# Altium schematic sheet Alimentation.SchDoc
size Letter; Organization: Cegep Limoilou; Address1: 1300, 8e Avenue; Address2: Québec, QC; Address3: Canada; Address4: G1J 5L5; Revision: Enseignants; SheetNumber: 5; SheetTotal: 8; Conception: Ilyes Gharmoul; Titre: Alimentation; Modification: Ilyes G
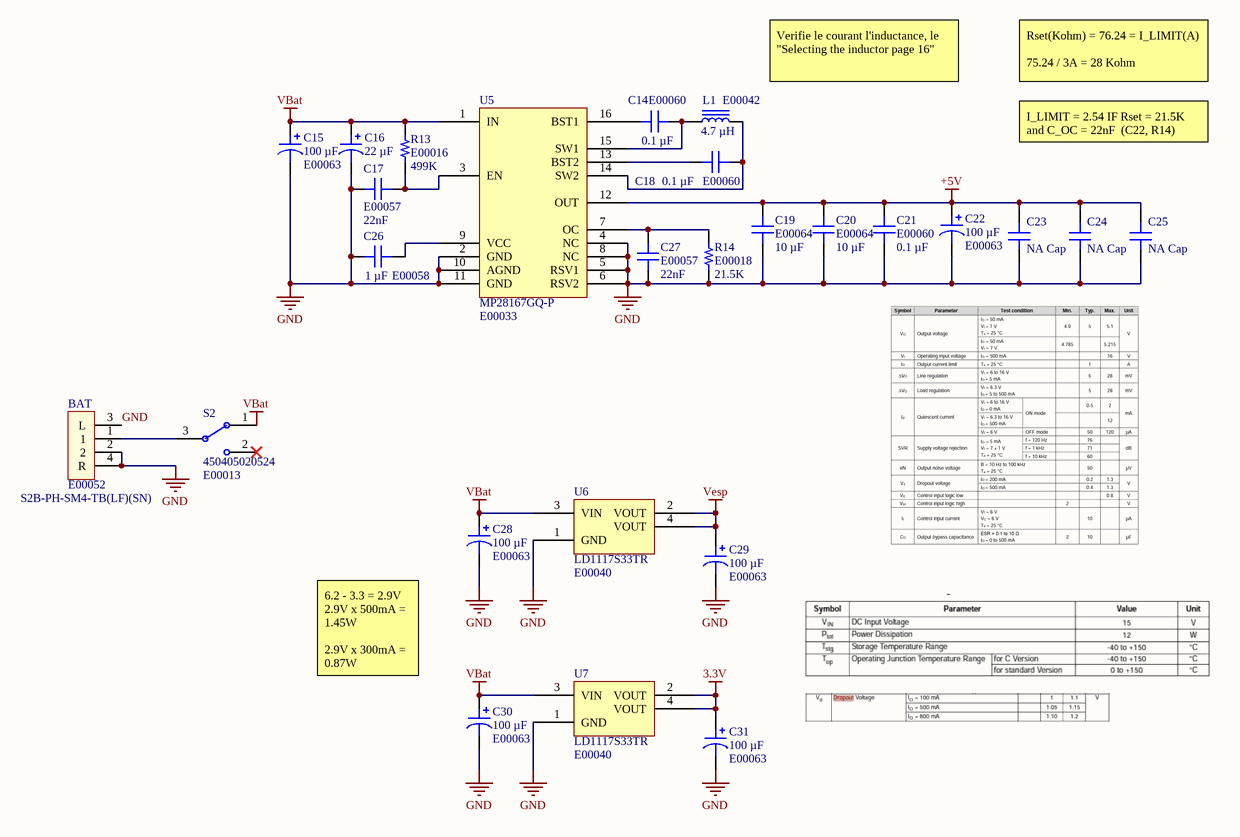
[diagram p0: Alimentation.SchDoc]

## Parts
BAT  ADAM Inventory Number 1: E00052  Supplier Part Number 1: S2B-PH-SM4-TB(LF)(SN)  [S2B-PH-SM4-TB_LF__SN]  (hidden comment: CONN JST 2P SM 90DEG)
C14  ADAM Inventory Number 1: E00060  [CAP 0603]  (hidden comment: 0.1 µF)
C15  100 µF  ADAM Inventory Number 1: E00063  [CAP ALSMD ELEC 8.3MM H10.5MM]
C16  22 µF  [CAP ALSMD 4.3MM H5.4MM]
C17  ADAM Inventory Number 1: E00057  [CAP 0603]  (hidden comment: 22nF)
C18  ADAM Inventory Number 1: E00060  [CAP 0603]  (hidden comment: 0.1 µF)
C19  ADAM Inventory Number 1: E00064  [CAP 0603]  (hidden comment: 10 µF)
C20  ADAM Inventory Number 1: E00064  [CAP 0603]  (hidden comment: 10 µF)
C21  ADAM Inventory Number 1: E00060  [CAP 0603]  (hidden comment: 0.1 µF)
C22  100 µF  ADAM Inventory Number 1: E00063  [CAP ALSMD ELEC 8.3MM H10.5MM]
C23  NA Cap  [CAP 0603]
C24  NA Cap  [CAP 0603]
C25  NA Cap  [CAP 0603]
C26  ADAM Inventory Number 1: E00058  [CAP 0603]  (hidden comment: 1 µF)
C27  ADAM Inventory Number 1: E00057  [CAP 0603]  (hidden comment: 22nF)
C28  100 µF  ADAM Inventory Number 1: E00063  [CAP ALSMD ELEC 8.3MM H10.5MM]
C29  100 µF  ADAM Inventory Number 1: E00063  [CAP ALSMD ELEC 8.3MM H10.5MM]
C30  100 µF  ADAM Inventory Number 1: E00063  [CAP ALSMD ELEC 8.3MM H10.5MM]
C31  100 µF  ADAM Inventory Number 1: E00063  [CAP ALSMD ELEC 8.3MM H10.5MM]
L1  4.7 µH  ADAM Inventory Number 1: E00042  [IND 4.7UH 4.6A]
R13  ADAM Inventory Number 1: E00016  [RES 0603]  (hidden comment: 499K)
R14  ADAM Inventory Number 1: E00018  [RES 0603]  (hidden comment: 21.5K)
S2  450405020524  ADAM Inventory Number 1: E00013  [SL 3Pos Switch]
U5  MP28167GQ-P  ADAM Inventory Number 1: E00033  [MP2816GQ-P]
U6  LD1117S33TR  ADAM Inventory Number 1: E00040  [SOT-223]
U7  LD1117S33TR  ADAM Inventory Number 1: E00040  [SOT-223]

## Nets
3.3V: C31.1 U7.2(VOUT) U7.4(VOUT)
+5V: C19.2 C20.2 C21.2 C22.1 C23.1 C24.1 C25.1 U5.12(OUT)
GND: BAT.2 BAT.3(L) BAT.4(R) C15.2 C16.2 C17.1 C19.1 C20.1 C21.1 C22.2 C23.2 C24.2 C25.2 C26.2 C27.1 C28.2 C29.2 C30.2 C31.2 R14.1 U5.2(GND) U5.4(NC) U5.5(RSV1) U5.6(RSV2) U5.8(NC) U5.10(AGND) U5.11(GND) U6.1(GND) U7.1(GND)
VBat: C15.1 C16.1 C28.1 C30.1 R13.2 S2.1 U5.1(IN) U6.3(VIN) U7.3(VIN)
Vesp: C29.1 U6.2(VOUT) U6.4(VOUT)
NetBAT_1: BAT.1 S2.3(COM)
NetC14_1: C14.1 L1.1 U5.15(SW1)
NetC14_2: C14.2 U5.16(BST1)
NetC17_2: C17.2 R13.1 U5.3(EN)
NetC18_1: C18.1 L1.2 U5.14(SW2)
NetC18_2: C18.2 U5.13(BST2)
NetC26_1: C26.1 U5.9(VCC)
NetC27_2: C27.2 R14.2 U5.7(OC)

Not connected (* = marked no-connect by the designer): S2 2*

## Notes on the sheet
- Verifie le courant l'inductance, le "Selecting the inductor page 16"
- Rset(Kohm) = 76.24 = I_LIMIT(A)
  75.24 / 3A = 28 Kohm
- I_LIMIT = 2.54 IF Rset = 21.5K and C_OC = 22nF  (C22, R14)
- 6.2 - 3.3 = 2.9V
  2.9V x 500mA =
  1.45W
  2.9V x 300mA =
  0.87W
- Titre :
- Conception :
- Date :
- Modification :
- Heure :
- Révision :
- Feuille
- de
- Fichier :

## Library data of the parts
BAT = CONN JST 2P SM 90DEG: CONN SM JST 2P; Copyright: Copyright (C) 2023 Ultra Librarian. All rights reserved.; Mfr_Name: JST; Manufacturer Part Number 1: S2B-PH-SM4-TB(LF)(SN); RefDes: RefDes; Type: DEV; Supplier 1: Arrow Electronics; Parameter 1: *
C14 C18 C21 = CAP CER 0.1UF 50V X7R 0603: Manufacturer Part Number 1: C0603C104K5RAC7411; manufacturer: KEMET; Tolerance: ±10%; Applications: Bypass, Decoupling; Capacitance: 0.1 µF; componentlink1description: Datasheet; componentlink1url: https://api.kemet.com/component-edge/download/datasheet/C0603C104K5RAC7411.pdf; componentlink2description: DigiKey Link; componentlink2url: https://www.digikey.com/en/products/detail/kemet/C0603C104K5RAC7411/3317013; Device Package: 0603 (1608 Metric); lastupdated: 2023-03-28 19:09:05; Lifecycle Status: Active; Minimum Order: 1; Mounting Type: Surface Mount, MLCC; Operating Temperature: -55°C ~ 125°C; Package / Case: 0603 (1608 Metric); packaging: TapeAndReel; partid: 2233; Part Status: Active; price: 0.01; series: SMD Comm X7R; Size / Dimension: 0.063" L x 0.031" W (1.60mm x 0.80mm); Supplier 1: DigiKey; Supplier Part Number 1: 399-C0603C104K5RAC7411CT-ND; Temperature Coefficient: X7R; Thickness (Max): 0.035" (0.90mm); Voltage - Rated: 50V; Value: 0.1 µF
C15 C22 C28-C31 = CAP ALUM 100UF 20% 50V SMD: Manufacturer Part Number 1: UWT1H101MNL1GS; manufacturer: Nichicon; Lifetime @ Temp.: 1000 Hrs @ 105°C; Polarization: Polar; Ripple Current @ High Frequency: 210 mA @ 10 kHz; Ripple Current @ Low Frequency: 140 mA @ 120 Hz; Surface Mount Land Size: 0.327" L x 0.327" W (8.30mm x 8.30mm); Applications: General Purpose; Capacitance: 100 µF; componentlink1description: Datasheet; componentlink1url: https://products.nichicon.co.jp/en/pdf/XJA043/e-uwt.pdf; componentlink2description: DigiKey Link; componentlink2url: https://www.digikey.com/en/products/detail/nichicon/UWT1H101MNL1GS/589967; Device Package: Radial, Can - SMD; Height - Seated (Max): 0.413" (10.50mm); lastupdated: 2023-04-08 20:11:02; Lifecycle Status: Active; Minimum Order: 1; Mounting Type: Surface Mount; Operating Temperature: -55°C ~ 105°C; Package / Case: Radial, Can - SMD; packaging: TapeAndReel; partid: 7453; Part Status: Active; price: 0.11; series: UWT; Size / Dimension: 0.315" Dia (8.00mm); Supplier 1: DigiKey; Supplier Part Number 1: 493-2226-1-ND; Tolerance: ±20%; value: 100 µF; Voltage - Rated: 50 V
C16 = EEE-1CA220WAR: CAP ALUM 22UF 20% 16V SMD; manufacturer: Panasonic Electronic Components; Lifetime @ Temp.: 1000 Hrs @ 85°C; Polarization: Polar; Ripple Current @ High Frequency: 47.6 mA @ 10 kHz; Ripple Current @ Low Frequency: 28 mA @ 120 Hz; Surface Mount Land Size: 0.169" L x 0.169" W (4.30mm x 4.30mm); Part Number: EEE-1CA220WAR; Applications: Automotive; Capacitance: 22 µF; componentlink1description: Datasheet; componentlink1url: https://industrial.panasonic.com/cdbs/www-data/pdf/RDE0000/ABA0000C1142.pdf; componentlink2description: DigiKey Link; componentlink2url: https://www.digikey.com/en/products/detail/panasonic-electronic-components/EEE-1CA220WAR/1717747; Device Package: Radial, Can - SMD; Height - Seated (Max): 0.213" (5.40mm); lastupdated: 2023-04-12 19:58:21; Lifecycle Status: Active; Minimum Order: 1; Mounting Type: Surface Mount; Operating Temperature: -40°C ~ 85°C; Package / Case: Radial, Can - SMD; packaging: TapeAndReel; partid: 7046; Part Status: Active; price: 0.07; Ratings: AEC-Q200; series: S; Size / Dimension: 0.157" Dia (4.00mm); Supplier 1: DigiKey; Supplier Part Number 1: PCE4581CT-ND; Tolerance: ±20%; value: 22 µF; Voltage - Rated: 16 V
C17 C27 = CAP CER 22NF 15V 10% 0603: CAP CER 22pF 15V 10% 0603, X7R; manufacturer: Taiyo Yuden; Manufacturer Part Number 1: EMF107B7223KAHT; Voltage - Rated: 16V; Applications: Automotive, SMPS Filtering; Capacitance: 22nF; componentlink1description: Datasheet; componentlink1url: https://ds.yuden.co.jp/TYCOMPAS/ut/detail?pn=EMF107B7223KAHT&u=M; componentlink2description: DigiKey Link; componentlink2url: https://www.digikey.com/en/products/detail/taiyo-yuden/EMF107B7223KAHT/10379118; Device Package: 0603 (1608 Metric); lastupdated: 2023-04-09 19:08:51; Lifecycle Status: Active; Minimum Order: 1; Mounting Type: Surface Mount, MLCC; Operating Temperature: -55°C ~ 125°C; Package / Case: 0603 (1608 Metric); packaging: TapeAndReel; partid: 4621; Part Status: Active; price: 0.02; Ratings: AEC-Q200; series: M; Size / Dimension: 0.063" L x 0.031" W (1.60mm x 0.80mm); Supplier 1: DigiKey; Supplier Part Number 1: 587-6552-1-ND; Temperature Coefficient: X7R; Thickness (Max): 0.035" (0.90mm); Tolerance: ±10%; Value: 22nF
C19 C20 = CAP 10UF 6.3V: CAP CER 10UF 6.3V X5R 0603; Manufacturer Part Number 1: GRM188R60J106ME47D; manufacturer: Murata Electronics; Tolerance: ±20%; Applications: General Purpose; Capacitance: 10 µF; componentlink1description: Datasheet; componentlink1url: https://www.murata.com/~/media/webrenewal/support/library/catalog/products/capacitor/mlcc/c02e.ashx?la=en-us; componentlink2description: DigiKey Link; componentlink2url: https://www.digikey.com/en/products/detail/murata-electronics/GRM188R60J106ME47D/965910; Device Package: 0603 (1608 Metric); lastupdated: 2023-03-30 19:09:15; Lifecycle Status: Active; Minimum Order: 1; Mounting Type: Surface Mount, MLCC; Operating Temperature: -55°C ~ 85°C; Package / Case: 0603 (1608 Metric); packaging: TapeAndReel; partid: 2351; Part Status: Active; price: 0.02; series: GRM; Size / Dimension: 0.063" L x 0.031" W (1.60mm x 0.80mm); Supplier 1: DigiKey; Supplier Part Number 1: 490-3896-1-ND; Temperature Coefficient: X5R; Thickness (Max): 0.035" (0.90mm); Voltage - Rated: 6.3V; Value: 10 µF
C23-C25 = NA Cap 0603: No capacitor, just in case; ADAM Inventory Number 1: E00080
C26 = CAP CER 1UF 16V X7R 0603: Manufacturer Part Number 1: C0603C105K4RACAUTO; manufacturer: KEMET; Tolerance: ±10%; Applications: Automotive, Bypass, Decoupling; Capacitance: 1 µF; componentlink1description: Datasheet; componentlink1url: https://api.kemet.com/component-edge/download/datasheet/C0603C105K4RACAUTO.pdf; componentlink2description: DigiKey Link; componentlink2url: https://www.digikey.com/en/products/detail/kemet/C0603C105K4RACAUTO/8635831; Device Package: 0603 (1608 Metric); lastupdated: 2023-03-30 19:09:16; Lifecycle Status: Active; Minimum Order: 0; Mounting Type: Surface Mount, MLCC; Operating Temperature: -55°C ~ 125°C; Package / Case: 0603 (1608 Metric); partid: 2179; Part Status: Active; price: 0; Ratings: AEC-Q200; series: SMD Auto X7R; Size / Dimension: 0.063" L x 0.031" W (1.60mm x 0.80mm); Supplier 1: DigiKey; Supplier Part Number 1: 399-17704-2-ND; Temperature Coefficient: X7R; Thickness (Max): 0.037" (0.95mm); Voltage - Rated: 16V; Value: 1 µF
L1 = IND 4.7UH 4.6A: FIXED IND 4.7UH 4.6A 53 MOHM SMD; Manufacturer Part Number 1: SRP5030T-4R7M; Manufacturer: Bourns Inc.; Current - Saturation: 6A; DC Resistance (DCR): 53mOhm Max; Inductance Frequency - Test: 100 kHz; Material - Core: Iron Powder; Shielding: Shielded; Tolerance: ±20%; Type: Drum Core, Wirewound; ComponentLink1Description: Datasheet; ComponentLink1URL: https://www.bourns.com/docs/Product-Datasheets/SRP5030T.pdf; ComponentLink2Description: DigiKey Link; ComponentLink2URL: https://www.digikey.com/en/products/detail/bourns-inc/SRP5030T-4R7M/3986084; Current Rating (Amps): 4.6 A; Device Package: Nonstandard; Height - Seated (Max): 0.118" (3.00mm); Inductance: 4.7 µH; LastUpdated: 2023-04-08 20:02:33; Lifecycle Status: Active; Minimum Order: 1; Mounting Type: Surface Mount; Operating Temperature: -40°C ~ 125°C; Package / Case: Nonstandard; Packaging: TapeAndReel; PartId: 1; Part Status: Active; Price: 0.61; Series: SRP5030T; Size / Dimension: 0.224" L x 0.205" W (5.70mm x 5.20mm); Supplier 1: DigiKey; Supplier Part Number 1: SRP5030T-4R7MCT-ND; Value: 4.7 µH
R13 = RES SMD 499K OHM: RES SMD 499K OHM 1% 1/4W 0603; Manufacturer: Vishay Dale; Manufacturer Part Number 1: RC0603FR-07499KL; Power (Watts): 0.25W, 1/4W; Temperature Coefficient: ±100ppm/°C; ComponentLink1Description: Datasheet; ComponentLink1URL: http://www.vishay.com/docs/20043/crcwhpe3.pdf; ComponentLink2Description: DigiKey Link; ComponentLink2URL: http://digikey.com/product-detail/en/vishay-dale/CRCW0603499KFKEAHP/541-499KSCT-ND/5326850; Composition: Thick Film; Device Package: 0603 (1608 Metric); Features: Automotive AEC-Q200, Pulse Withstanding; Height - Seated (Max): 0.022" (0.55mm); LastUpdated: 2023-04-09 19:29:36; Lifecycle Status: Active; Minimum Order: 1; Number of Terminations: 2; Operating Temperature: -55°C ~ 155°C; Package / Case: 0603 (1608 Metric); Packaging: TapeAndReel; PartId: 14787; Part Status: Active; Price: 0.02; Ratings: AEC-Q200; Resistance: 499K; Series: CRCW-HP; Size / Dimension: 0.063" L x 0.033" W (1.60mm x 0.85mm); Supplier Device Package: 0603; Tolerance: ±1%; Supplier 1: Future Electronics; Supplier Part Number 1: 1580604; Value: 499K
R14 = RES SMD 21.5K OHM: RES SMD 21.5K OHM 0.1% 1/5W 0603; Manufacturer: Panasonic Electronic Components; Manufacturer Part Number 1: CRCW0603321K5FKEA; Power (Watts): 0.2W, 1/5W; Temperature Coefficient: ±50ppm/°C; ComponentLink1Description: Datasheet; ComponentLink1URL: https://industrial.panasonic.com/cdbs/www-data/pdf/RDM0000/AOA0000C328.pdf; ComponentLink2Description: DigiKey Link; ComponentLink2URL: https://www.digikey.com/en/products/detail/panasonic-electronic-components/ERJ-PB3B2152V/6212904; Composition: Thick Film; Device Package: 0603 (1608 Metric); Features: Automotive AEC-Q200, Pulse Withstanding; Height - Seated (Max): 0.022" (0.55mm); LastUpdated: 2023-04-09 19:29:59; Lifecycle Status: Active; Minimum Order: 1; Number of Terminations: 2; Operating Temperature: -55°C ~ 155°C; Package / Case: 0603 (1608 Metric); Packaging: TapeAndReel; PartId: 9207; Part Status: Active; Price: 0.02; Ratings: AEC-Q200; Resistance: 21.5K; Series: ERJ-PB3; Size / Dimension: 0.063" L x 0.031" W (1.60mm x 0.80mm); Supplier Device Package: 0603; Tolerance: ±0.1%; Supplier 1: Mouser; Supplier Part Number 1: 71-CRCW0603-21.5K-E3; Value: 21.5K
S2 = SLIDE SWIT: SMT 8.7 X 3.0 MM MINI SLIDE SWIT; Manufacturer: Würth Elektronik; Rated Current: 300mA; Rated Voltage: 5VDC; Switching Function: On-On; Circuit: SPDT; Actuator Length: 2.00mm; Actuator Type: Standard; Contact Timing: Non-Shorting (BBM); Current Rating (Amps): 300mA (DC); Voltage Rating - DC: 5 V; ComponentLink1Description: Datasheet; ComponentLink1URL: https://www.we-online.com/catalog/datasheet/450405020524.pdf; ComponentLink2Description: DigiKey Link; ComponentLink2URL: https://www.digikey.com/en/products/detail/würth-elektronik/450405020524/11627297; Packaging: TapeAndReel; Publisher: Wurth Elektronik; Contact Material: Copper Alloy; Mounting Technology: SMT; Operating Temperature: -40°C ~ 85°C; Contact Plating: Silver; Manufacturer Part Number 1: 450405020524; Published Date: November 2019; Terminal Material: Copper Alloy; Size: 8.7x3mm; Terminal Plating: Silver; Contact Finish: Silver; LastUpdated: 2022-06-20 13:21:27; Lifecycle Status: Active; Minimum Order: 1; Mounting Type: Surface Mount; PartId: 4; Part Status: Active; Price: 0.73; Series: WS-SLSU; Supplier 1: DigiKey; Supplier Part Number 1: 732-450405020524CT-ND; Switch Function: On-On; Termination Style: SMD (SMT) Tab
U5 = MP28167GQ-P: Buck-Boost Switching Regulator IC Positive Fixed 5V 1 Output 3A 16-PowerVFQFN; Supplier 1: Digi-Key; Supplier Part Number 1: 1589-MP28167GQ-PCT-ND; Manufacturer Part Number 1: MP28167GQ-P
U6 U7 = LD1117S33TR: IC REG LINEAR 3.3V 800MA SOT223; Manufacturer: STMicroelectronics; Current - Quiescent (Iq): 10 mA; Number of Regulators: 1; Output Configuration: Positive; Output Type: Fixed; Protection Features: Over Current, Over Temperature; PSRR: 75dB (120Hz); Voltage Dropout (Max): 1.2V @ 800mA; Voltage - Input (Max): 15V; Manufacturer Part Number 1: LD1117S33TR; ComponentLink1Description: Datasheet; ComponentLink1URL: http://www.st.com/content/ccc/resource/technical/document/datasheet/99/3b/7d/91/91/51/4b/be/CD00000544.pdf/files/CD00000544.pdf/jcr:content/translations/en.CD00000544.pdf; ComponentLink2Description: DigiKey Link; ComponentLink2URL: https://www.digikey.com/en/products/detail/stmicroelectronics/LD1117S33TR/585766; Current - Output: 800mA; LastUpdated: 2023-03-27 20:01:10; Lifecycle Status: Active; Minimum Order: 1; Mounting Type: Surface Mount; Operating Temperature: 0°C ~ 125°C; Package / Case: TO-261-4, TO-261AA; Packaging: TapeAndReel; Part Status: Active; Price: 0.21; Series: -; Supplier 1: DigiKey; Supplier Part Number 1: 497-1242-1-ND; Supplier Device Package: SOT-223; Voltage - Output (Min/Fixed): 3.3V